# EAGLE design smart bldc commutator (EAGLE 6.5.0)
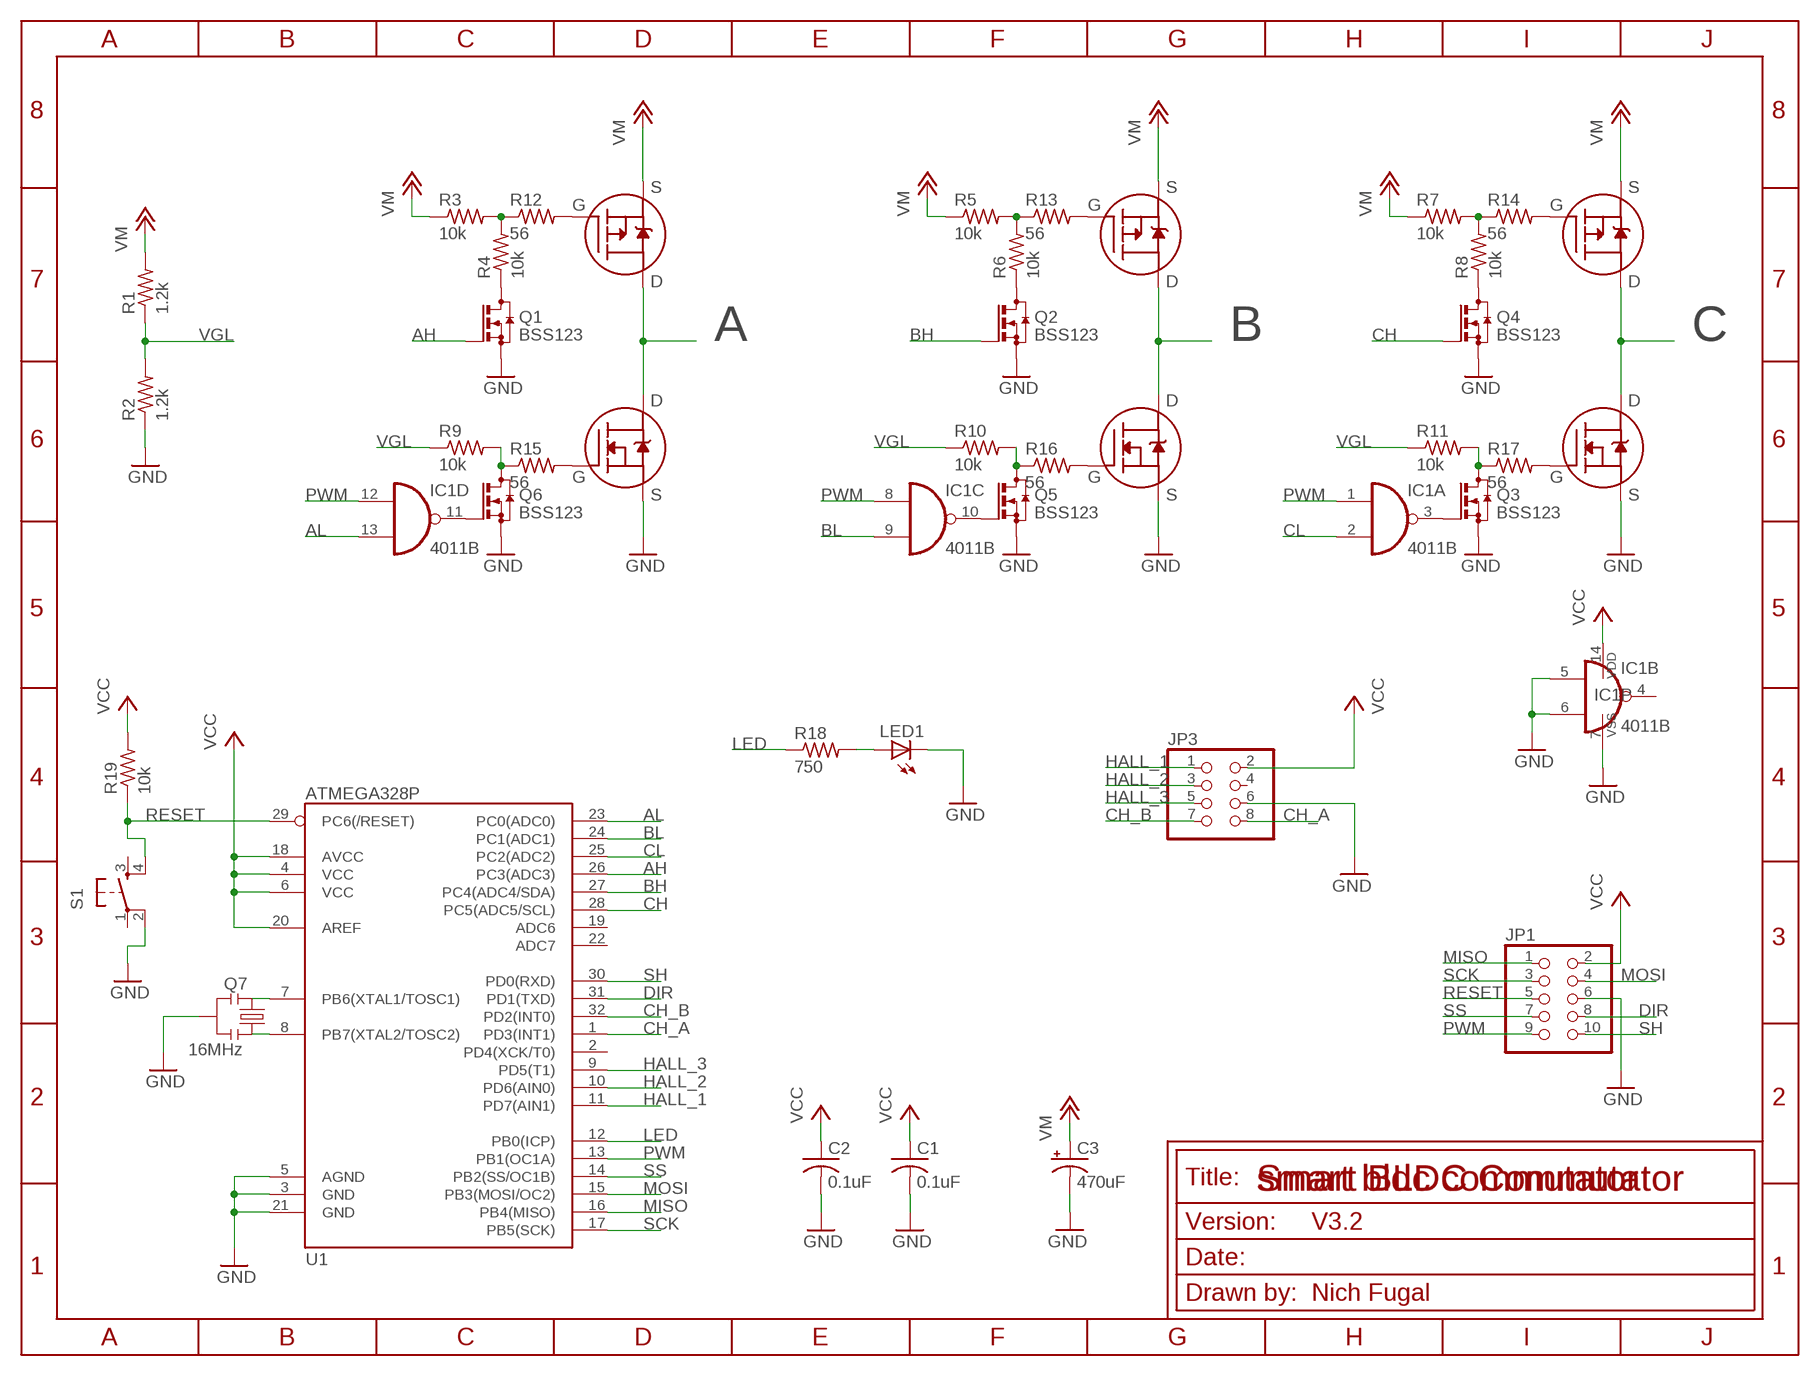
[diagram p0: schematic, sheet 1]

## Parts
C1  0.1uF  C-USC0805  [C0805]
C2  0.1uF  C-USC0805  [C0805]
C3  470uF  CPOL-USE5-10.5  [E5-10,5]
IC1  4011B  4011D  [SO14]
JP1  PINHD-2X5  [2X05]
JP3  PINHD-2X4  [2X04]
LED1  LEDCHIP-LED0805  [CHIP-LED0805]
Q1  BSS123  [SOT23]
Q2  BSS123  [SOT23]
Q3  BSS123  [SOT23]
Q4  BSS123  [SOT23]
Q5  BSS123  [SOT23]
Q6  BSS123  [SOT23]
Q7  16MHz  RESONATORSMD  [RESONATOR-SMD]
R1  1.2k  R-US_R0805  [R0805]
R2  1.2k  R-US_R0805  [R0805]
R3  10k  R-US_R0805  [R0805]
R4  10k  R-US_R0805  [R0805]
R5  10k  R-US_R0805  [R0805]
R6  10k  R-US_R0805  [R0805]
R7  10k  R-US_R0805  [R0805]
R8  10k  R-US_R0805  [R0805]
R9  10k  R-US_R0805  [R0805]
R10  10k  R-US_R0805  [R0805]
R11  10k  R-US_R0805  [R0805]
R12  56  R-US_R0805  [R0805]
R13  56  R-US_R0805  [R0805]
R14  56  R-US_R0805  [R0805]
R15  56  R-US_R0805  [R0805]
R16  56  R-US_R0805  [R0805]
R17  56  R-US_R0805  [R0805]
R18  750  R-US_R0805  [R0805]
R19  10k  R-US_R0805  [R0805]
S1  TAC_SWITCHSMD  [TACTILE_SWITCH_SMD]
U1  ATMEGA328P  ATMEGA168  [TQFP32-08]
U$1  IRF4905  [D2PAK]
U$2  IRF1404S  [D2PAK]
U$3  IRF4905  [D2PAK]
U$4  IRF1404S  [D2PAK]
U$5  IRF4905  [D2PAK]
U$6  IRF1404S  [D2PAK]

## Nets
A: U$1.2(D) U$2.2(D)
AH: Q1.1(G) U1.26(PC3(ADC3))
AL: IC1.13(D:I1) U1.23(PC0(ADC0))
B: U$3.2(D) U$4.2(D)
BH: Q2.1(G) U1.27(PC4(ADC4/SDA))
BL: IC1.9(C:I1) U1.24(PC1(ADC1))
C: U$5.2(D) U$6.2(D)
CH: Q4.1(G) U1.28(PC5(ADC5/SCL))
CH_A: JP3.8 U1.1(PD3(INT1))
CH_B: JP3.7 U1.32(PD2(INT0))
CL: IC1.2(A:I1) U1.25(PC2(ADC2))
DIR: JP1.8 U1.31(PD1(TXD))
GND: C1.2 C2.2 C3.- IC1.5(B:I0) IC1.6(B:I1) IC1.7(P:VSS) JP1.6 JP3.6 LED1.C Q1.2(S) Q2.2(S) Q3.2(S) Q4.2(S) Q5.2(S) Q6.2(S) Q7.2 R2.1 S1.2 U1.3(GND) U1.5(AGND) U1.21(GND) U$2.3(S) U$4.3(S) U$6.3(S)
HALL_1: JP3.1 U1.11(PD7(AIN1))
HALL_2: JP3.3 U1.10(PD6(AIN0))
HALL_3: JP3.5 U1.9(PD5(T1))
LED: R18.1 U1.12(PB0(ICP))
MISO: JP1.1 U1.16(PB4(MISO))
MOSI: JP1.4 U1.15(PB3(MOSI/OC2))
N$1: Q7.3 U1.7(PB6(XTAL1/TOSC1))
N$2: Q7.1 U1.8(PB7(XTAL2/TOSC2))
N$3: Q6.3(D) R9.2 R15.1
N$4: R12.2 U$1.1(G)
N$5: Q5.3(D) R10.2 R16.1
N$6: Q4.3(D) R8.1
N$7: R15.2 U$2.1(G)
N$8: R3.2 R4.2 R12.1
N$9: R13.2 U$3.1(G)
N$10: R14.2 U$5.1(G)
N$11: R5.2 R6.2 R13.1
N$12: Q3.3(D) R11.2 R17.1
N$13: IC1.3(A:O) Q3.1(G)
N$14: Q2.3(D) R6.1
N$15: R16.2 U$4.1(G)
N$16: R17.2 U$6.1(G)
N$17: R7.2 R8.2 R14.1
N$18: LED1.A R18.2
N$19: IC1.10(C:O) Q5.1(G)
N$21: Q1.3(D) R4.1
N$22: IC1.11(D:O) Q6.1(G)
PWM: IC1.1(A:I0) IC1.8(C:I0) IC1.12(D:I0) JP1.9 U1.13(PB1(OC1A))
RESET: JP1.5 R19.1 S1.4 U1.29(PC6(/RESET))
SCK: JP1.3 U1.17(PB5(SCK))
SH: JP1.10 U1.30(PD0(RXD))
SS: JP1.7 U1.14(PB2(SS/OC1B))
VCC: C1.1 C2.1 IC1.14(P:VDD) JP1.2 JP3.2 R19.2 U1.4(VCC) U1.6(VCC) U1.18(AVCC) U1.20(AREF)
VGL: R1.1 R2.2 R9.1 R10.1 R11.1
VM: C3.+ R1.2 R3.1 R5.1 R7.1 U$1.3(S) U$3.3(S) U$5.3(S)
Unconnected: IC1.4(B:O) JP3.4 S1.1 S1.3 U1.2(PD4(XCK/T0)) U1.19(ADC6) U1.22(ADC7)

## Notes on the sheet
- A | B | C
- Smart BLDC Commutator
- V3.2
- Nich Fugal

## Library data of the parts
C1 C2 = rcl:C-US: CAPACITOR, American symbol
C3 = rcl:CPOL-US: POLARIZED CAPACITOR, American symbol
IC1 = 40xx:4011: Quad 2-input NAND
JP1 = pinhead:PINHD-2X5: PIN HEADER
JP3 = pinhead:PINHD-2X4: PIN HEADER
LED1 = led:LED: LED OSRAM: - CHIPLED LG R971, LG N971, LY N971, LG Q971, LY Q971, LO R971, LY R971 LH N974, LH R974 LS Q976, LO Q976, LY Q976 LO Q996 - Hyper CHIPLED LW Q18S LB Q993, LB Q99A, LB R99A - SideLED LS A670, LO A670, LY A670, LG A670, LP A670 LB A673, LV A673, LT A673, LW A673 LH A674 LY A675 LS A676, LA A676, LO A676, LY A676, LW A676 LS A679, LY A679, LG A679 - Hyper Micro SIDELED® LS Y876, LA Y876, LO Y876, LY Y876 LT Y87S - SmartLED LW L88C, LW L88S LB L89C, LB L89S, LG L890 LS L89K, LO L89K, LY L89K LS L896, LA L896, LO L896, LY L896 - TOPLED LS T670, LO T670, LY T670, LG T670, LP T670 LSG T670, LSP T670, LSY T670, LOP T670, LYG T670 LG T671, LOG T671, LSG T671 LB T673, LV T673, LT T673, LW T673 LH T674 LS T676, LA T676, LO T676, LY T676, LB T676, LH T676, LSB T676, LW T676 LB T67C, LV T67C, LT T67C, LS T67K, LO T67K, LY T67K, LW E67C LS E67B, LA E67B, LO E67B, LY E67B, LB E67C, LV E67C, LT E67C LW T67C LS T679, LY T679, LG T679 LS T770, LO T770, LY T770, LG T770, LP T770 LB T773, LV T773, LT T773, LW T773 LH T774 LS E675, LA E675, LY E675, LS T675 LS T776, LA T776, LO T776, LY T776, LB T776 LHGB T686 LT T68C, LB T68C - Hyper Mini TOPLED® LB M676 - Mini TOPLED Santana® LG M470 LS M47K, LO M47K, LY M47K Source: http://www.osram.convergy.de LUXEON: - LUMILED® LXK2-PW12-R00, LXK2-PW12-S00, LXK2-PW14-U00, LXK2-PW14-V00 LXK2-PM12-R00, LXK2-PM12-S00, LXK2-PM14-U00 LXK2-PE12-Q00, LXK2-PE12-R00, LXK2-PE12-S00, LXK2-PE14-T00, LXK2-PE14-U00 LXK2-PB12-K00, LXK2-PB12-L00, LXK2-PB12-M00, LXK2-PB14-N00, LXK2-PB14-P00, LXK2-PB14-Q00 LXK2-PR12-L00, LXK2-PR12-M00, LXK2-PR14-Q00, LXK2-PR14-R00 LXK2-PD12-Q00, LXK2-PD12-R00, LXK2-PD12-S00 LXK2-PH12-R00, LXK2-PH12-S00 LXK2-PL12-P00, LXK2-PL12-Q00, LXK2-PL12-R00 Source: www.luxeon.com KINGBRIGHT: KA-3528ASYC Source: www.kingbright.com
Q1-Q6 = transistor-small-signal:BSS123: N-CHANNEL MOS FET
Q7 = sparkfun:RESONATOR: Resonator Small SMD resonator. This is the itty bitty 10/20MHz resonators with built in caps. CSTCE10M0G55 and CSTCE20M0V53. Footprint has been reviewed closely but hasn't been tested yet.
R1-R19 = rcl:R-US_: RESISTOR, American symbol
S1 = sparkfun:TAC_SWITCH: Momentary Switch Button commonly used for reset or general input. Spark Fun Electronics SKU : COM-00097
U1 = sparkfun:ATMEGA168
U$1 U$3 U$5 = nich:IRF4905
U$2 U$4 U$6 = nich:IRF1404S

## Board
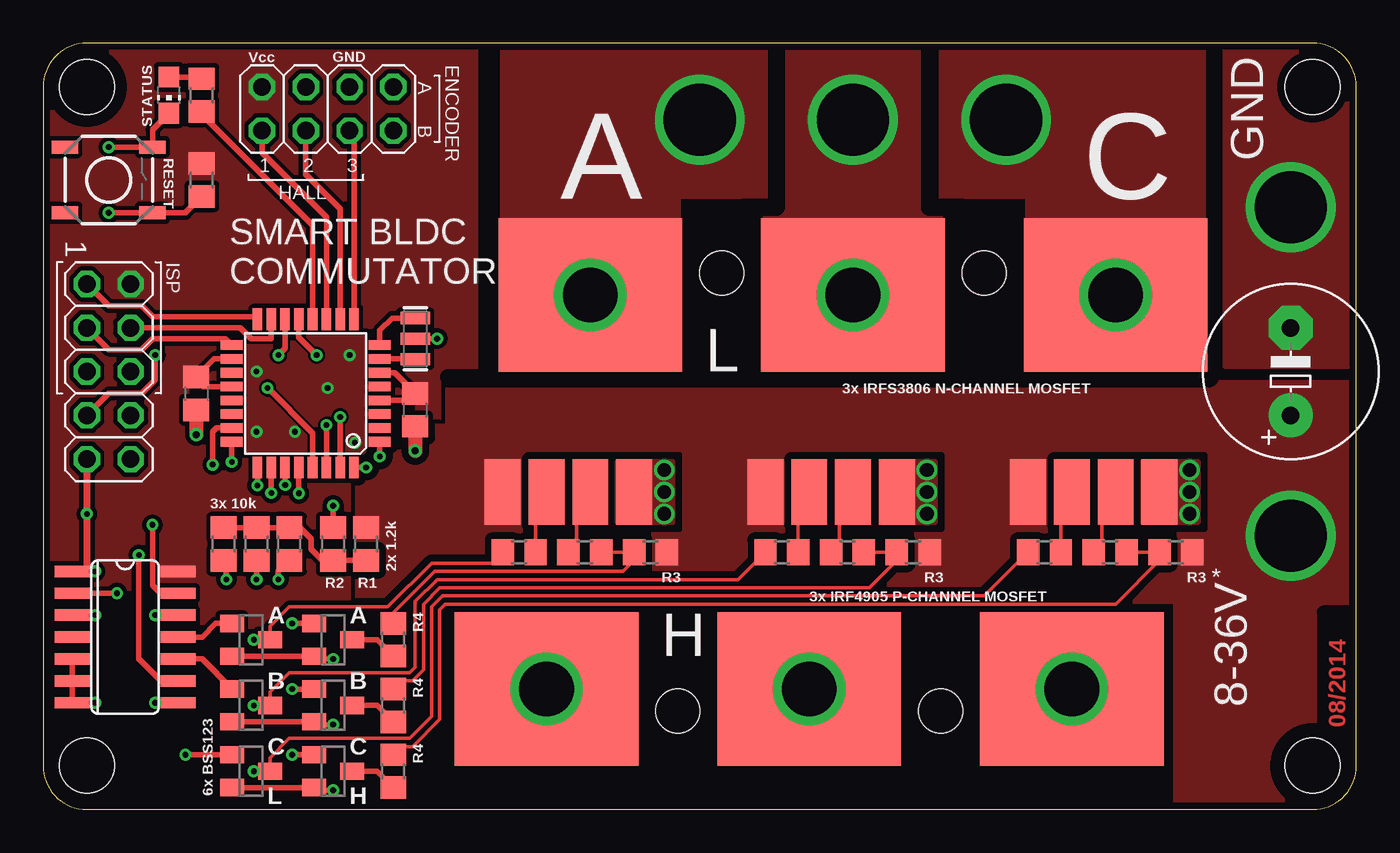
[diagram p1: board, top side]
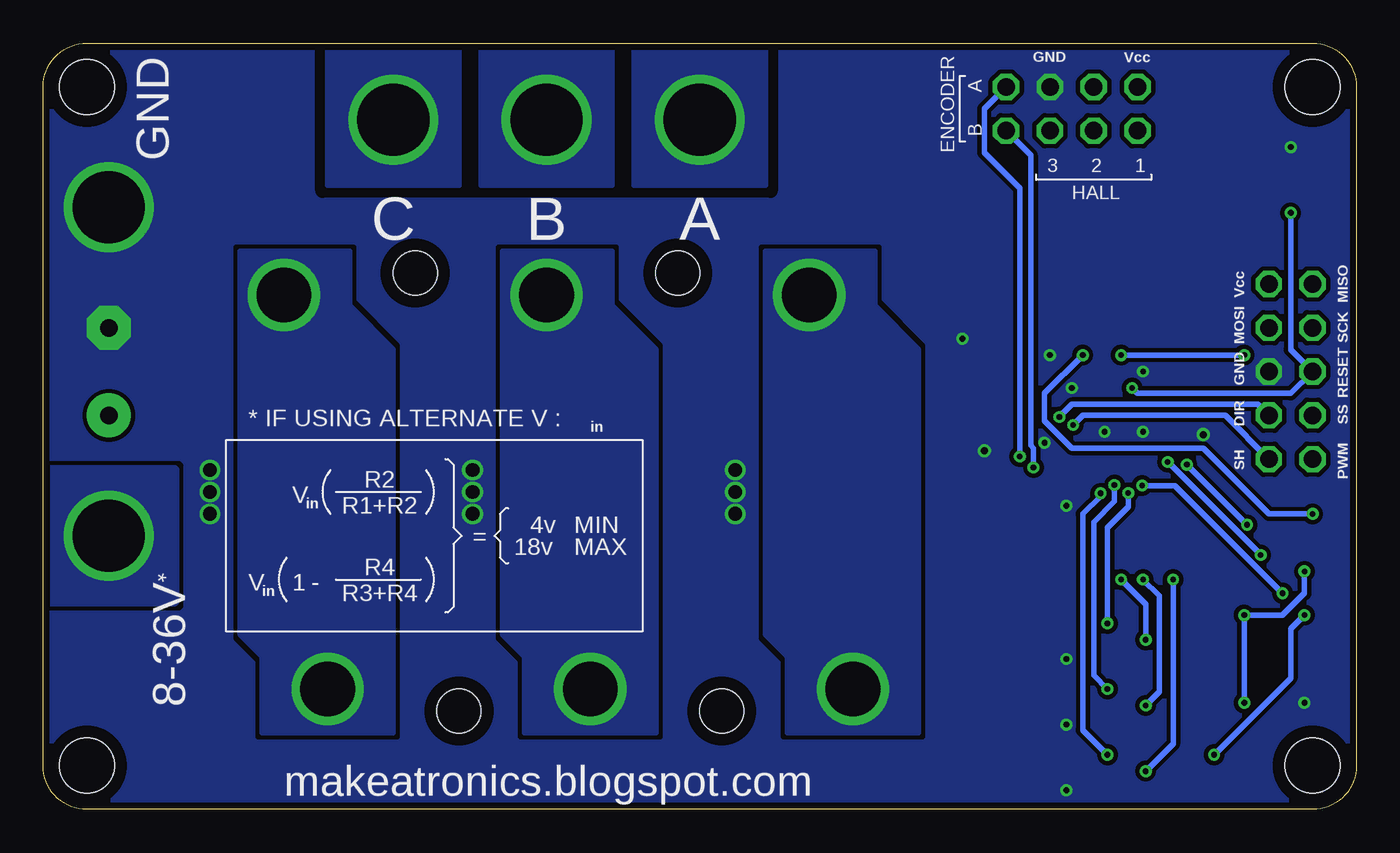
[diagram p2: board, bottom side, seen from below]

Size 76.2 x 44.45 mm. Coordinates in mm from the lower left corner, seen from the top.
Outline: 2.54,0 73.66,0 arc90 76.2,2.54 76.2,41.91 arc90 73.66,44.45 2.54,44.45 arc90 0,41.91 0,2.54 arc90 2.54,0
Copper layers (1*16): Top 0.0356mm / dielectric 1.5011mm / Bottom 0.0356mm
Design rules "OSHPark": minimum track width 6mil, minimum drill 13mil, track to track 6mil, track to pad 6mil, pad to pad 6mil, via to via 6mil, smd to smd 6mil, copper to edge 15mil, drill to drill 6mil, minimum pad ring 7mil, minimum via ring 7mil, stop-mask expansion 4mil, vias tented up to drill 0mil, thermal gap 10mil
Holes 3.17 mm at 2.54,2.54 73.66,2.54 2.54,41.91 73.66,41.91
Holes 2.54 mm at 39.37,31.11 54.61,31.11 52.07,5.71 36.83,5.71
tRestrict: area 0.6,40 to 4.4,43.8; area 71.8,40 to 75.6,43.8; area 0.6,0.6 to 4.4,4.4; area 71.8,0.6 to 75.6,4.4; area 37.8,29.5 to 41,32.7; area 53,29.5 to 56.2,32.7; area 50.5,4.1 to 53.7,7.3; area 35.2,4.1 to 38.4,7.3; area 74.3,3.8 to 76.2,11.4; 13 lines
bRestrict: area 0.6,40 to 4.4,43.8; area 0.6,0.6 to 4.4,4.4; area 71.8,0.6 to 75.6,4.4; area 71.8,40 to 75.6,43.8; area 37.8,29.5 to 41,32.7; area 53,29.5 to 56.2,32.7; area 50.5,4.1 to 53.7,7.3; area 35.2,4.1 to 38.4,7.3; 3 lines

### Footprints (pad centres in the part's own frame; a part is rotated, then mirrored left to right if it is on the bottom)
C0805 = smd 1.3 x 1.5: 1 -0.95,0; 2 0.95,0
E5-10,5 = drill 1.016 pad 2.54: + -2.54,0 | drill 1.016 pad 2.54 octagon: - 2.54,0
SO14 = smd 0.66 x 2.032: 1 -3.81,-3.073; 2 -2.54,-3.073; 3 -1.27,-3.073; 4 0,-3.073; 5 1.27,-3.073; 6 2.54,-3.073; 7 3.81,-3.073; 8 3.81,3.073; 9 2.54,3.073; 10 1.27,3.073; 11 0,3.073; 12 -1.27,3.073; 13 -2.54,3.073; 14 -3.81,3.073
2X05 = drill 1.016 octagon: 1 -5.08,-1.27; 2 -5.08,1.27; 3 -2.54,-1.27; 4 -2.54,1.27; 5 0,-1.27; 6 0,1.27; 7 2.54,-1.27; 8 2.54,1.27; 9 5.08,-1.27; 10 5.08,1.27
2X04 = drill 1.016 octagon: 1 -3.81,-1.27; 2 -3.81,1.27; 3 -1.27,-1.27; 4 -1.27,1.27; 5 1.27,-1.27; 6 1.27,1.27; 7 3.81,-1.27; 8 3.81,1.27
CHIP-LED0805 = smd 1.2 x 1.2: A 0,-1.05; C 0,1.05
SOT23 = smd 1 x 1.4: 1 -0.95,-1.1; 2 0.95,-1.1; 3 0,1.1
RESONATOR-SMD = smd 0.7 x 1.7: 1 -1.2,0; 2 0,0; 3 1.2,0
R0805 = smd 1.3 x 1.5: 1 -0.95,0; 2 0.95,0
TACTILE_SWITCH_SMD = smd 1.524 x 0.762: 1 -2.54,1.905; 2 2.54,1.905; 3 -2.54,-1.905; 4 2.54,-1.905
TQFP32-08 = smd 1.27 x 0.559: 1 -4.293,2.8; 2 -4.293,2; 3 -4.293,1.2; 4 -4.293,0.4; 5 -4.293,-0.4; 6 -4.293,-1.2; 7 -4.293,-2; 8 -4.293,-2.8; 17 4.293,-2.8; 18 4.293,-2; 19 4.293,-1.2; 20 4.293,-0.4; 21 4.293,0.4; 22 4.293,1.2; 23 4.293,2; 24 4.293,2.8 | smd 0.559 x 1.27: 9 -2.8,-4.293; 10 -2,-4.293; 11 -1.2,-4.293; 12 -0.4,-4.293; 13 0.4,-4.293; 14 1.2,-4.293; 15 2,-4.293; 16 2.8,-4.293; 25 2.8,4.293; 26 2,4.293; 27 1.2,4.293; 28 0.4,4.293; 29 -0.4,4.293; 30 -1.2,4.293; 31 -2,4.293; 32 -2.8,4.293
D2PAK = smd 2.083 x 3.81: 1 -2.54,-4.445; 3 2.54,-4.445 | smd 10.668 x 8.89: 2 0,6.985

### Placement (x,y rotation side)
C1  8.89,24.13 270 top
C2  21.59,23.18 270 top
C3  72.39,25.4 90 top
IC1  4.76,10 270 top
JP1  3.81,25.4 270 top
JP3  16.51,40.64 0 top
LED1  7.3,41.43 180 top
Q1  16.83,9.84 270 top
Q2  16.83,6.03 270 top
Q3  12.06,2.22 270 top
Q4  16.83,2.22 270 top
Q5  12.06,6.03 270 top
Q6  12.06,9.84 270 top
Q7  21.59,27.3 270 top
R1  18.73,15.4 90 top
R2  16.83,15.4 270 top
R3  35.24,14.92 180 top
R4  20.32,9.84 90 top
R5  50.48,14.92 180 top
R6  20.32,6.03 90 top
R7  65.72,14.92 180 top
R8  20.32,2.22 90 top
R9  14.29,15.4 270 top
R10  12.38,15.4 270 top
R11  10.48,15.4 270 top
R12  31.43,14.92 180 top
R13  46.67,14.92 180 top
R14  61.91,14.92 180 top
R15  27.62,14.92 0 top
R16  42.86,14.92 0 top
R17  58.1,14.92 0 top
R18  9.21,41.43 90 top
R19  9.21,36.51 90 top
S1  3.81,36.51 0 top
U1  15.24,24.13 180 top
U$1  29.21,13.97 180 top
U$2  31.75,22.86 0 top
U$3  44.45,13.97 180 top
U$4  46.99,22.86 0 top
U$5  59.69,13.97 180 top
U$6  62.23,22.86 0 top

### Tracks (layer width: path | path; a pad name or v marks a point on that pad's centre or on a via)
A  (via drill 3.17, 4.19)
  other vias: 29.21,6.99 31.75,29.84 38.1,40.01
  pour Bottom (isolate 0.406, no thermals): 27.94,32.38 27.94,29.21 25.4,26.67 25.4,4.45 33.02,4.45 33.02,8.89 34.29,10.16 34.29,32.38
  pour Top (isolate 0.406, rank 2, no thermals): 26.67,44.45 41.91,44.45 41.91,35.56 36.83,35.56 36.83,25.4 26.67,25.4
  pour Bottom: 34.29,44.45 34.29,36.2 41.91,36.2 41.91,44.45
AH  (via drill 0.33)
  Top 0.305: U1.26 v13.24,18.35 | Q1.1 v14.45,10.79
  Bottom 0.305: v13.24,18.35 13.24,17.56 14.45,16.35 v14.45,10.79
AL  (via drill 0.33)
  Top 0.305: U1.23 10.06,22.13 9.84,21.91 v9.84,20 | IC1.13 6.83,12.54 6.35,13.02 v6.35,16.51
  Bottom 0.305: v9.84,20 v6.35,16.51
B  (via drill 3.17, 4.19)
  other vias: 44.45,6.99 46.99,29.84 46.99,40.01
  pour Bottom (isolate 0.406, no thermals): 43.18,32.38 49.53,32.38 49.53,10.16 48.26,8.89 48.26,4.45 40.64,4.45 40.64,26.67 43.18,29.21
  pour Top (isolate 0.406, rank 3, no thermals): 41.91,44.45 52.07,44.45 52.07,25.4 41.91,25.4
  pour Bottom: 43.18,44.45 43.18,36.2 50.8,36.2 50.8,44.45
BH  (via drill 0.33)
  Top 0.305: U1.27 v14.04,18.82 | Q2.1 v14.45,6.98 v14.45,6.99
  Bottom 0.305: v14.04,18.82 14.04,17.87 15.24,16.67 15.24,7.78 v14.45,6.99
BL  (via drill 0.33)
  Top 0.305: U1.24 v10.95,20.16 | IC1.9 6.83,7.46 5.56,8.73 v5.56,14.76
  Bottom 0.305: v10.95,20.16 v5.56,14.76
C  (via drill 3.17, 4.19)
  other vias: 62.23,29.84 59.69,6.99 55.88,40.01
  pour Bottom (isolate 0.406, no thermals): 58.42,32.38 64.77,32.38 64.77,10.16 63.5,8.89 63.5,4.45 55.88,4.45 55.88,26.67 58.42,29.21
  pour Top (isolate 0.406, rank 2, no thermals): 52.07,44.45 67.31,44.45 67.31,25.4 57.15,25.4 57.15,35.56 52.07,35.56
  pour Bottom: 52.07,44.45 52.07,36.2 59.69,36.2 59.69,44.45
CH  (via drill 0.33)
  Top 0.305: U1.28 v14.84,18.34 | Q4.1 v14.45,3.17
  Bottom 0.305: v14.84,18.34 14.84,18.18 15.88,17.14 15.88,4.6 v14.45,3.17
CH_A  (via drill 0.33)
  Top 0.305: U1.1 v19.53,20.47
  Bottom 0.305: v19.53,20.47 19.53,36.04 21.59,38.1 21.59,40.64 JP3.8
CH_B  (via drill 0.33)
  Top 0.305: U1.32 v18.74,19.84
  Bottom 0.305: v18.74,19.84 v18.73,19.84 18.73,20.95 18.9,21.12 18.9,37.95 JP3.7
CL  (via drill 0.33)
  Top 0.305: U1.25 v12.44,18.79 | IC1.2 v4.29,12.54
  Bottom 0.305: v4.29,12.54 10.54,18.79 v12.44,18.79
DIR  (via drill 0.33)
  Top 0.305: v17.24,22.77 U1.31
  Bottom 0.305: JP1.8 5.71,23.5 16.51,23.5 v17.24,22.77
GND  (via drill 0.33, 0.41, 0.8, 4.19)
  Top 0.305: Q7.2 v22.86,27.3 | R2.1 v16.83,17.62 | v16.83,1.11 15.89,1.11 Q4.2 Q3.2 | v16.83,4.92 15.89,4.92 Q2.2 Q5.2 | v16.83,8.73 15.89,8.73 Q1.2 Q6.2 | v3.81,38.42 S1.2 6.35,39.43 LED1.C | v3.02,6.19 IC1.7 IC1.6 IC1.5
  Top 0.813: C1.2 v8.89,21.75 | C2.2 v21.59,20.8
  other vias: 72.39,34.92 12.38,25.4 12.38,21.91 16.51,24.45 17.78,26.35 18.1,21.27 14.61,21.91 36.04,19.68 36.04,18.41 36.04,17.14 51.28,19.68 51.28,18.41 51.28,17.14 66.52,19.68 66.52,18.41 66.52,17.14
  pour Bottom (isolate 0.254, rank 2, no thermals): 0,44.45 76.2,44.45 76.2,0 0,0
  pour Top: 11.43,26.99 11.43,21.27 12.38,20.32 18.1,20.32 19.05,21.27 19.05,26.99 18.1,27.94 12.38,27.94
  pour Top (rank 2, no thermals): 76.2,25.72 68.58,25.72 68.58,44.45 76.2,44.45
  pour Top (no thermals): 33.34,20.16 33.34,16.67 36.51,16.67 36.51,20.16
  pour Top (no thermals): 48.74,20.16 48.74,16.67 51.75,16.67 51.75,20.16
  pour Top (no thermals): 63.82,20.16 63.82,16.67 66.99,16.67 66.99,20.16
HALL_1
  Top 0.305: U1.11 16.44,34.36 12.7,38.1 JP3.1
HALL_2
  Top 0.305: U1.10 17.24,34.83 15.24,36.83 JP3.3
HALL_3
  Top 0.305: U1.9 18.04,39.11 JP3.5
LED
  Top 0.305: U1.12 15.64,33.89 9.21,40.33 R18.1
MISO
  Top 0.305: JP1.1 3.81,29.21 5.71,29.21 6.35,28.57 12.29,28.57 U1.16
MOSI
  Top 0.305: JP1.4 11.43,27.94 12.06,27.3 13.24,27.3 U1.15
N$1
  Top 0.305: U1.7 21.57,26.13 Q7.3
N$2
  Top 0.305: U1.8 19.53,27.79 20.25,28.5 Q7.1
N$3  (via drill 0.33)
  Top 0.203: Q6.3 13.16,10.62 14.29,11.75 20,11.75 22.54,14.29 26.04,14.29 R15.1 26.99,14.92
  Top 0.305: R9.2 13.65,13.81 v13.65,13.34 | Q6.3 v12.22,9.84
  Bottom 0.305: 13.49,13.18 v13.65,13.34 12.22,11.91 v12.22,9.84
N$4
  Top 0.203: R12.2 30.96,15.4 30.96,17.3 31.75,18.1 U$1.1
N$5  (via drill 0.33)
  Top 0.203: Q5.3 13.16,6.82 14.29,7.94 21.27,7.94 21.59,8.26 21.59,12.06 22.86,13.34 40.33,13.34 R16.1
  Top 0.305: R10.2 v12.38,13.34 | Q5.3 v12.22,6.03
  Bottom 0.305: v12.38,13.34 11.43,12.38 11.43,6.83 v12.22,6.03
N$6
  Top 0.305: Q4.3 19.37,2.22 R8.1
N$7
  Top 0.203: R15.2 28.57,17.78 U$2.1
N$8
  Top 0.203: R4.2 20.8,11.27 20.16,11.27 22.7,13.81 33.66,13.81 34.29,14.45 R3.2 R12.1
N$9
  Top 0.203: R13.2 46.2,15.4 46.2,17.14 46.99,17.94 U$3.1
N$10
  Top 0.203: R14.2 61.44,15.4 61.44,17.14 62.23,17.94 U$5.1
N$11
  Top 0.203: R6.2 20.8,7.46 21.43,7.46 22.07,8.1 22.07,11.91 23.02,12.86 47.94,12.86 49.53,14.45 R5.2 R13.1
N$12  (via drill 0.33)
  Top 0.203: Q3.3 13.16,3 14.29,4.13 21.27,4.13 22.54,5.4 22.54,11.75 23.18,12.38 54.61,12.38 R17.1
  Top 0.305: R11.2 10.64,14.13 v10.64,13.34 | Q3.3 v12.22,2.22
  Bottom 0.305: v10.64,13.34 10.64,3.81 v12.22,2.22
N$13  (via drill 0.33)
  Top 0.305: Q3.1 v8.26,3.17 | IC1.3 v3.02,11.27
  Bottom 0.305: v8.26,3.17 3.81,7.62 3.81,10.48 v3.02,11.27
N$14
  Top 0.305: Q2.3 19.37,6.03 R6.1
N$15
  Top 0.203: R16.2 43.81,17.78 U$4.1
N$16
  Top 0.203: R17.2 59.05,17.78 U$6.1
N$17
  Top 0.203: R8.2 20.8,3.65 21.43,3.65 23.02,5.24 23.02,11.59 23.34,11.91 62.23,11.91 64.77,14.45 R7.2 R14.1
N$18
  Top 0.305: R18.2 9.11,42.48 LED1.A
N$19
  Top 0.305: IC1.10 9.22,8.73 Q5.1
N$21
  Top 0.305: Q1.3 19.37,9.84 R4.1
N$22
  Top 0.305: IC1.11 9.22,10 10.01,10.79 Q6.1
PWM  (via drill 0.33)
  Top 0.305: U1.13 14.84,27.39 v15.88,26.35 | IC1.12 v6.51,11.27 | IC1.8 v6.51,6.19 | v3.02,13.81 IC1.1
  Top 0.406: JP1.9 v2.54,17.14 2.54,13.81 IC1.1
  Bottom 0.305: v15.88,26.35 18.1,24.13 18.1,22.54 16.51,20.95 8.89,20.95 5.08,17.14 v2.54,17.14 | v6.51,6.19 v6.51,11.27 4.29,11.27 3.02,12.54 v3.02,13.81
RESET  (via drill 0.33)
  Top 0.305: v13.02,24.45 15.64,21.82 U1.29 | v3.81,34.61 S1.4 8.25,34.61 R19.1
  Bottom 0.305: v13.02,24.45 12.7,24.13 3.81,24.13 JP1.5 3.81,26.67 v3.81,34.61
SCK
  Top 0.305: JP1.3 3.81,26.67 5.71,26.67 6.35,27.3 10.57,27.3 U1.17
SH  (via drill 0.33)
  Top 0.305: v16.44,22.3 U1.30
  Bottom 0.305: JP1.10 7.62,22.86 15.88,22.86 v16.44,22.3
SS  (via drill 0.33)
  Top 0.305: JP1.7 3.81,24.13 5.71,24.13 6.51,24.92 v6.51,26.35 | v13.65,26.35 14.04,26.74 U1.14
  Bottom 0.305: v6.51,26.35 v13.65,26.35
VCC
  Top 0.305: U1.4 21.19,23.73 C2.1 20.39,25.33 U1.6 | U1.20 9.28,24.53 C1.1 9.94,26.13 U1.18
  pour Top (isolate 0.254, rank 3, no thermals): 0,44.45 25.08,44.13 25.08,0 0,0
VGL
  Top 0.305: 14.45,16.35 R9.1 | R1.1 R2.2 16.19,14.45 15.56,15.08 15.56,15.72 14.93,16.35 R9.1 | R9.1 R10.1 R11.1
VM  (via drill 4.19)
  other vias: 72.39,15.88
  pour Top (isolate 0.406, rank 2, no thermals): 18.26,22.23 18.26,12.06 65.72,12.06 65.72,0.16 76.2,0 76.2,24.77 23.5,24.77 23.5,22.23
  pour Bottom (isolate 0.406, no thermals): 68.58,19.68 68.58,12.06 76.2,12.06 76.2,19.68

### Text on the board
Top: 08/2014
tStop: V3.2
_tsilk: GND | GND | STATUS | Vcc | ENCODER | A | B | RESET | 1 | 2 | 3 | HALL | A | C | 1 | ISP | SMART BLDC / COMMUTATOR | L | 3x IRFS3806 N-CHANNEL MOSFET | 3x 10k | 2x 1.2k | R3 | R3 | * | 8-36V | 3x IRF4905 P-CHANNEL MOSFET | A | A | H | R4 | B | B | R4 | C | C | 6x BSS123 | L | H
_bsilk: GND | GND | Vcc | A | B | 1 | 2 | 3 | ENCODER | HALL | A | B | C | MISO | Vcc | SCK | RESET | MOSI | GND | SS | DIR | in | * IF USING ALTERNATE V : | PWM | SH | V | R2 / R1+R2 | in | MIN | 4v | = | MAX | 18v | - | 1 | V | 8-36V | * | R4 / R3+R4 | in | makeatronics.blogspot.com